# EAGLE schematic openservo (EAGLE 4.11)
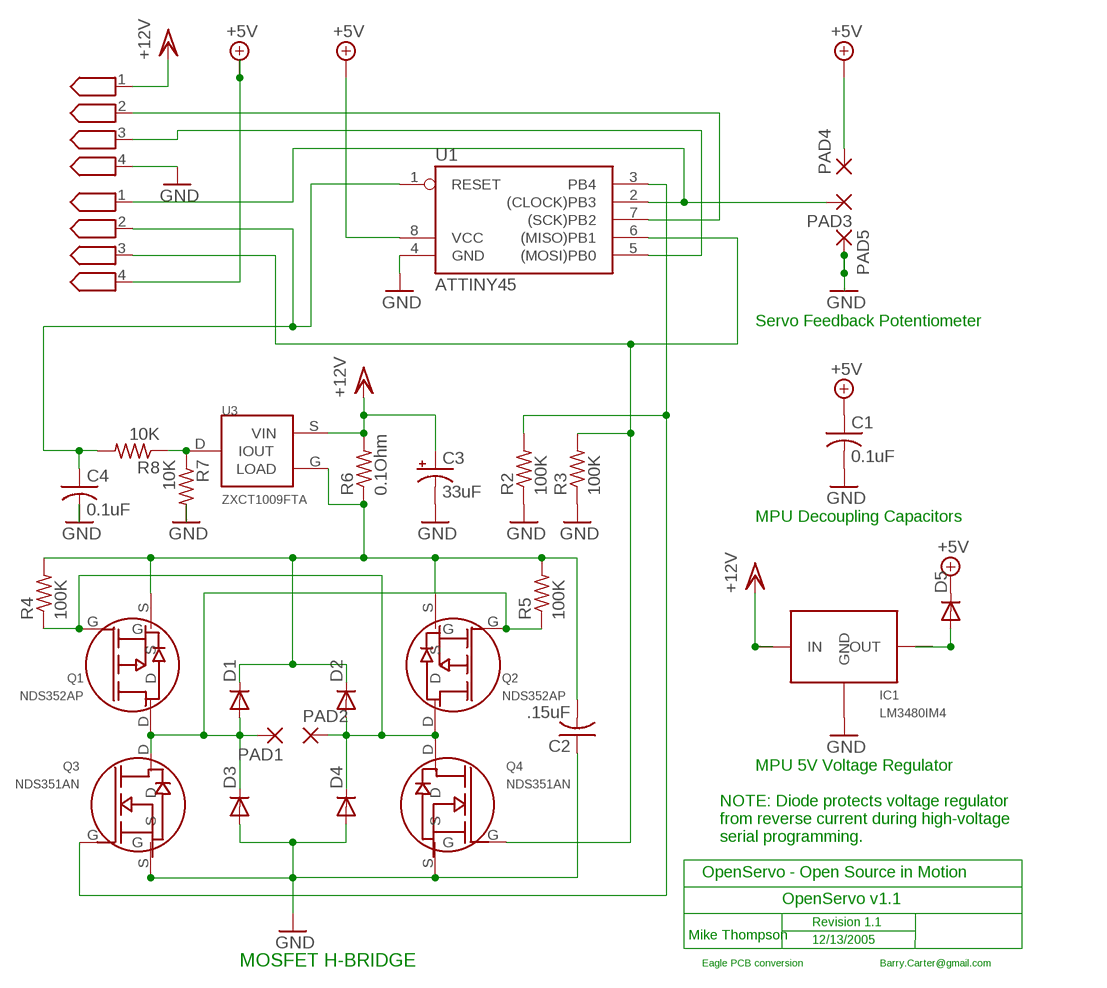
[diagram p0: schematic, sheet 1]

## Parts
C1  0.1uF  C-USC0603  [C0603]
C2  .15uF  C-USC0603  [C0603]
C3  33uF  CPOL-US153CLV-0405  [153CLV-0405]
C4  0.1uF  C-USC0603K  [C0603K]
D1  DIODE-SOD123  [SOD123]
D2  DIODE-SOD123  [SOD123]
D3  DIODE-SOD123  [SOD123]
D4  DIODE-SOD123  [SOD123]
D5  DIODE-SOD323-W  [SOD323-W]
IC1  LM3480IM4  [SOT-3]
PAD1  2,15/1,0  [2,15/1,0]
PAD2  2,15/1,0  [2,15/1,0]
PAD3  1,6/0,8  [1,6/0,8]
PAD4  1,6/0,8  [1,6/0,8]
PAD5  1,6/0,8  [1,6/0,8]
Q1  NDS352AP  [SOT-3]
Q2  NDS352AP  [SOT-3]
Q3  NDS351AN  [SOT-3]
Q4  NDS351AN  [SOT-3]
R2  100K  R-US_R0603  [R0603]
R3  100K  R-US_R0603  [R0603]
R4  100K  R-US_R0603  [R0603]
R5  100K  R-US_R0603  [R0603]
R6  0.1Ohm  R-US_R0603  [R0603]
R7  10K  R-US_R0603  [R0603]
R8  10K  R-US_R0603  [R0603]
U1  ATTINY45  TINY22S  [SOIC8]
U3  ZXCT1009FTA  [SOT-3]
U$1  4-EDGE  [4-PIN-EDGE]
U$2  4-EDGE  [4-PIN-EDGE]

## Nets
+5V: C1.1 D5.C PAD4.1(P) U1.8(VCC) U$2.4
GND: C1.2 C2.1 C3.- C4.2 D3.A D4.A IC1.D(GND) PAD5.1(P) Q3.S Q4.S R2.1 R3.1 R7.2 U1.4(GND) U$1.4
N$1: D5.A IC1.G(OUT)
N$2: C4.1 R8.2 U1.1(RESET) U$2.2
N$4: D2.A D4.C PAD2.1(P) Q1.G Q2.D Q4.D R4.1
N$5: D1.A D3.C PAD1.1(P) Q1.D Q2.G Q3.D R5.1
N$8: U1.5((MOSI)PB0) U$1.3
N$10: C2.2 D1.C D2.C Q1.S Q2.S R4.2 R5.2 R6.1 U3.G(LOAD)
N$11: Q4.G R3.2 U1.6((MISO)PB1) U$2.3
N$12: R7.1 R8.1 U3.D(IOUT)
N$13: U1.7((SCK)PB2) U$1.2
N$14: PAD3.1(P) U1.2((CLOCK)PB3) U$2.1
N$15: Q3.G R2.2 U1.3(PB4)
VCC/2: C3.+ IC1.S(IN) R6.2 U3.S(VIN) U$1.1 ; supply symbol labelled +12V

## Notes on the sheet
- Servo Feedback Potentiometer
- MPU Decoupling Capacitors
- MPU 5V Voltage Regulator
- NOTE: Diode protects voltage regulator
- from reverse current during high-voltage
- serial programming.
- OpenServo - Open Source in Motion
- OpenServo v1.1
- Revision 1.1
- Mike Thompson
- 12/13/2005
- MOSFET H-BRIDGE | Eagle PCB conversion | Barry.Carter@gmail.com

## Library data of the parts
C1 C2 C4 = rcl:C-US: CAPACITOR, American symbol
C3 = rcl:CPOL-US: POLARIZED CAPACITOR, American symbol
D1-D5 = diode:DIODE-: DIODE
IC1 = openservo:LM3480IM4
PAD1 PAD2 = wirepad:2,15/1,0: THROUGH-HOLE PAD
PAD3-PAD5 = wirepad:1,6/0,8: THROUGH-HOLE PAD
Q1 Q2 = openservo:NDS352AP
Q3 Q4 = openservo:NDS351AN
R2-R8 = rcl:R-US_: RESISTOR, American symbol
U1 = atmel:TINY22: MICROCONTROLLER 1K ROM 128 bytes RAM 128 bytes EEPROM
U3 = openservo:ZXCT1009FTA
U$1 U$2 = openservo:4-EDGE